# EAGLE design thewing_rev0 (EAGLE 9.2.2)

## Sheet 1 of 3
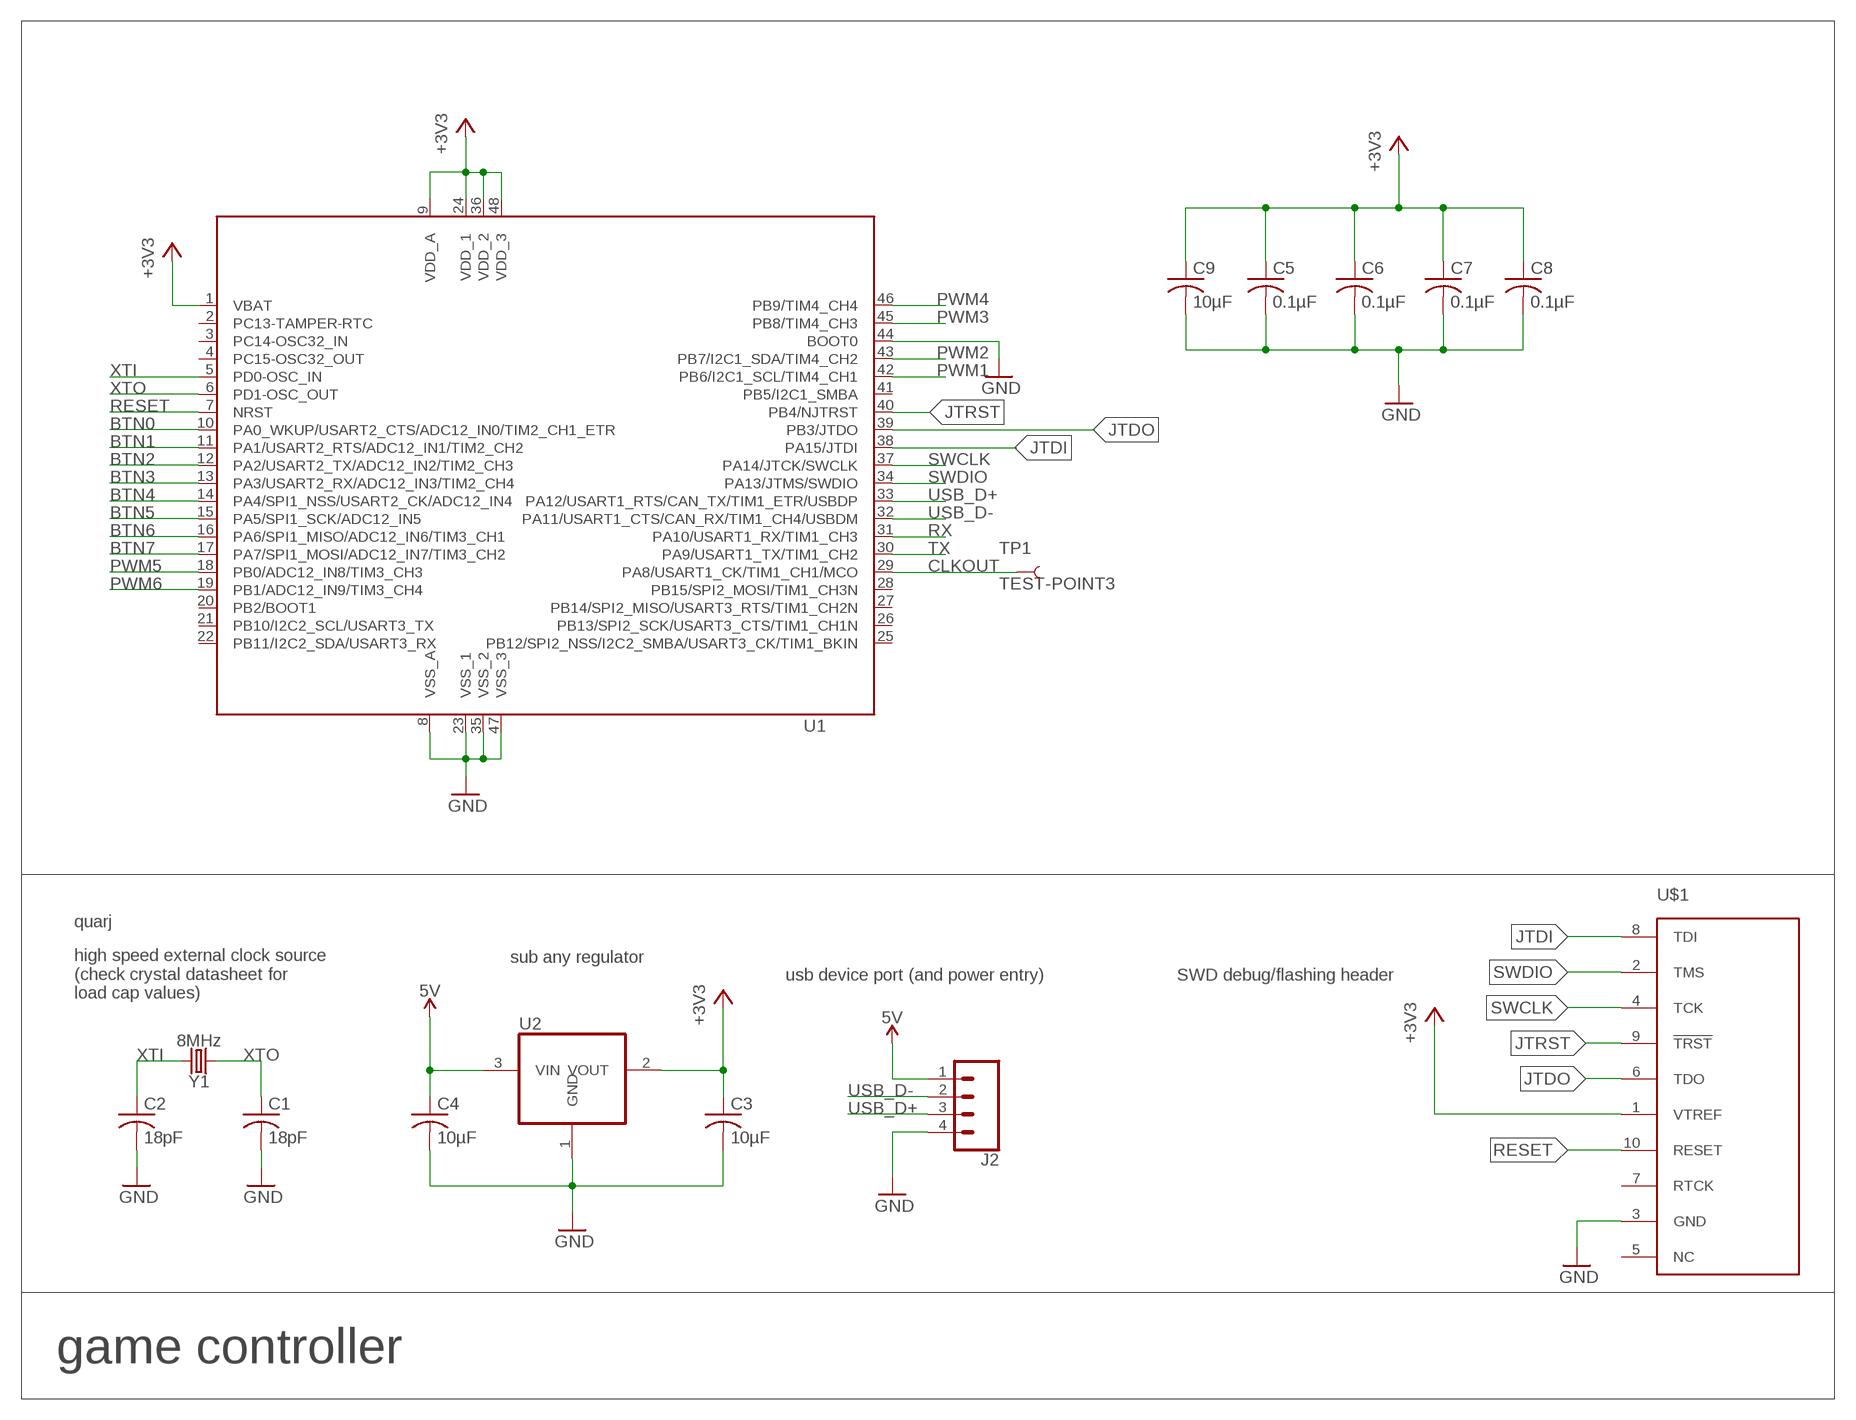
[diagram p0: schematic, sheet 1]

### Parts
C1  18pF  RCL_C-USC0805K  [RCL_C0805K]
C2  18pF  RCL_C-USC0805K  [RCL_C0805K]
C3  10µF  RCL_C-USC0805K  [RCL_C0805K]
C4  10µF  RCL_C-USC0805K  [RCL_C0805K]
C5  0.1µF  RCL_C-USC0805K  [RCL_C0805K]
C6  0.1µF  RCL_C-USC0805K  [RCL_C0805K]
C7  0.1µF  RCL_C-USC0805K  [RCL_C0805K]
C8  0.1µF  RCL_C-USC0805K  [RCL_C0805K]
C9  10µF  RCL_C-USC0805K  [RCL_C0805K]
J2  CONN_04  [1X04]
TP1  TEST-POINT3  [PAD.03X.03]
U1  STM32_STM32F102C4  [STM32_LQFP48]
U2  OG-VREG_REG1117  [OG-VREG_SOT223]
U$1  TC2050-NL-MCP-NL  [TC2030-MCP-NL]
Y1  8MHz  CRYSTAL-8MHZSMD-HC49UP  [HC49UP]

### Nets
5V: C4.1 J2.1 U2.3(VIN)
+3V3: C3.1 C5.1 C6.1 C7.1 C8.1 C9.1 U1.1(VBAT) U1.9(VDD_A) U1.24(VDD_1) U1.36(VDD_2) U1.48(VDD_3) U2.2(VOUT) U$1.1(VTREF) ; also sheet 2
BTN0: U1.10(PA0_WKUP/USART2_CTS/ADC12_IN0/TIM2_CH1_ETR) ; also sheet 2
BTN1: U1.11(PA1/USART2_RTS/ADC12_IN1/TIM2_CH2) ; also sheet 2
BTN2: U1.12(PA2/USART2_TX/ADC12_IN2/TIM2_CH3) ; also sheet 3
BTN3: U1.13(PA3/USART2_RX/ADC12_IN3/TIM2_CH4) ; also sheet 3
BTN4: U1.14(PA4/SPI1_NSS/USART2_CK/ADC12_IN4) ; also sheet 3
BTN5: U1.15(PA5/SPI1_SCK/ADC12_IN5) ; also sheet 3
BTN6: U1.16(PA6/SPI1_MISO/ADC12_IN6/TIM3_CH1) ; also sheet 3
BTN7: U1.17(PA7/SPI1_MOSI/ADC12_IN7/TIM3_CH2) ; also sheet 3
CLKOUT: TP1.P$1 U1.29(PA8/USART1_CK/TIM1_CH1/MCO)
GND: C1.2 C2.2 C3.2 C4.2 C5.2 C6.2 C7.2 C8.2 C9.2 J2.4 U1.8(VSS_A) U1.23(VSS_1) U1.35(VSS_2) U1.44(BOOT0) U1.47(VSS_3) U2.1(GND) U$1.3(GND) ; also sheet 2,3
JTDI: U1.38(PA15/JTDI) U$1.8(TDI)
JTDO: U1.39(PB3/JTDO) U$1.6(TDO)
JTRST: U1.40(PB4/NJTRST) U$1.9(!TRST)
PWM1: U1.42(PB6/I2C1_SCL/TIM4_CH1) ; also sheet 2
PWM2: U1.43(PB7/I2C1_SDA/TIM4_CH2) ; also sheet 2
PWM3: U1.45(PB8/TIM4_CH3) ; also sheet 2
PWM4: U1.46(PB9/TIM4_CH4) ; also sheet 2
PWM5: U1.18(PB0/ADC12_IN8/TIM3_CH3) ; also sheet 2
PWM6: U1.19(PB1/ADC12_IN9/TIM3_CH4) ; also sheet 2
RESET: U1.7(NRST) U$1.10(RESET)
RX: U1.31(PA10/USART1_RX/TIM1_CH3)
SWCLK: U1.37(PA14/JTCK/SWCLK) U$1.4(TCK)
SWDIO: U1.34(PA13/JTMS/SWDIO) U$1.2(TMS)
TX: U1.30(PA9/USART1_TX/TIM1_CH2)
USB_D+: J2.3 U1.33(PA12/USART1_RTS/CAN_TX/TIM1_ETR/USBDP)
USB_D-: J2.2 U1.32(PA11/USART1_CTS/CAN_RX/TIM1_CH4/USBDM)
XTI: C2.1 U1.5(PD0-OSC_IN) Y1.2
XTO: C1.1 U1.6(PD1-OSC_OUT) Y1.1
Unconnected: U1.2(PC13-TAMPER-RTC) U1.3(PC14-OSC32_IN) U1.4(PC15-OSC32_OUT) U1.20(PB2/BOOT1) U1.21(PB10/I2C2_SCL/USART3_TX) U1.22(PB11/I2C2_SDA/USART3_RX) U1.25(PB12/SPI2_NSS/I2C2_SMBA/USART3_CK/TIM1_BKIN) U1.26(PB13/SPI2_SCK/USART3_CTS/TIM1_CH1N) U1.27(PB14/SPI2_MISO/USART3_RTS/TIM1_CH2N) U1.28(PB15/SPI2_MOSI/TIM1_CH3N) U1.41(PB5/I2C1_SMBA) U$1.5(NC) U$1.7(RTCK)

### Notes on the sheet
- quarj
- sub any regulator
- usb device port (and power entry) | SWD debug/flashing header
- high speed external clock source
  (check crystal datasheet for 
  load cap values)
- game controller

## Sheet 2 of 3
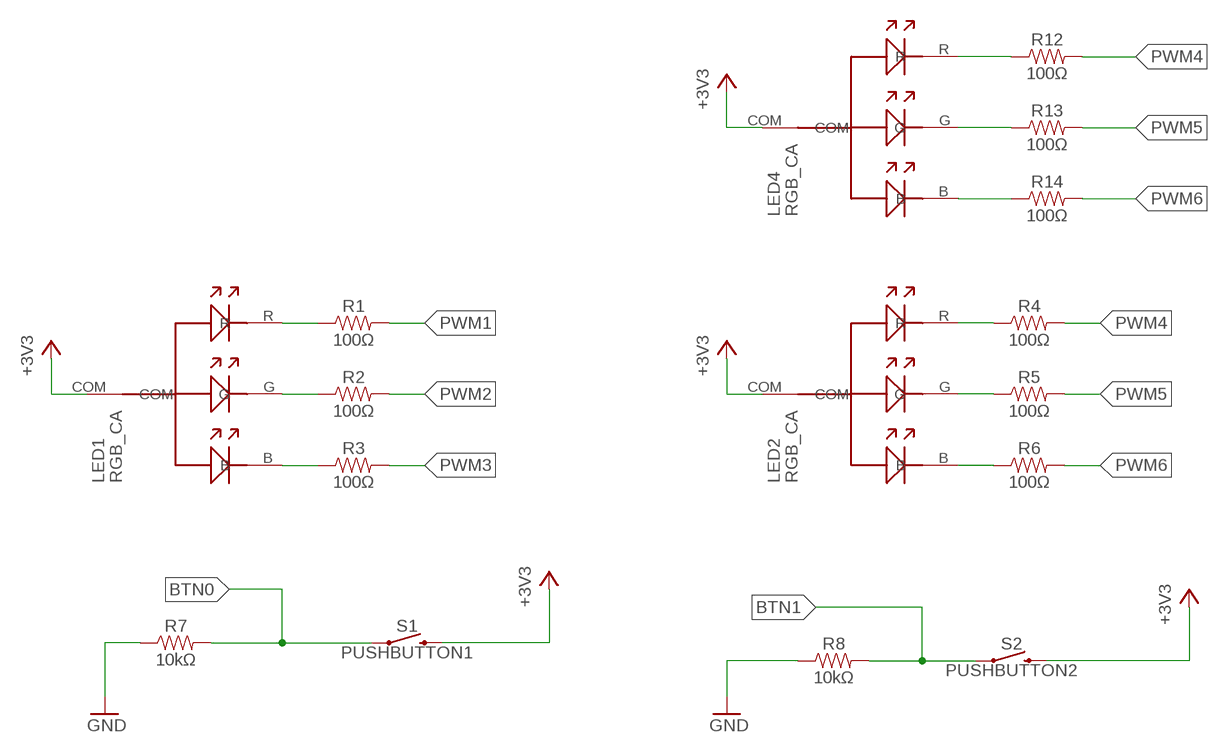
[diagram p1: schematic, sheet 2]

### Parts
LED1  RGB_CA  RGB_LED_RECTANGULAR_COMMON_ANODE  [RGB_LED_RECTANGULAR_COMMON_ANODE]
LED2  RGB_CA  RGB_LED_RECTANGULAR_COMMON_ANODE  [RGB_LED_RECTANGULAR_COMMON_ANODE]
LED4  RGB_CA  RGB_LED_RECTANGULAR_COMMON_ANODE  [RGB_LED_RECTANGULAR_COMMON_ANODE]
R1  100Ω  0.3OHM-0805-1/8W-1%  [0805]
R2  100Ω  0.3OHM-0805-1/8W-1%  [0805]
R3  100Ω  0.3OHM-0805-1/8W-1%  [0805]
R4  100Ω  0.3OHM-0805-1/8W-1%  [0805]
R5  100Ω  0.3OHM-0805-1/8W-1%  [0805]
R6  100Ω  0.3OHM-0805-1/8W-1%  [0805]
R7  10kΩ  0.3OHM-0805-1/8W-1%  [0805]
R8  10kΩ  0.3OHM-0805-1/8W-1%  [0805]
R12  100Ω  0.3OHM-0805-1/8W-1%  [0805]
R13  100Ω  0.3OHM-0805-1/8W-1%  [0805]
R14  100Ω  0.3OHM-0805-1/8W-1%  [0805]
S1  PUSHBUTTON1  MOMENTARY-SWITCH-SPST-PTH-6.0MM  [TACTILE_SWITCH_PTH_6.0MM]
S2  PUSHBUTTON2  MOMENTARY-SWITCH-SPST-PTH-6.0MM  [TACTILE_SWITCH_PTH_6.0MM]

### Nets
+3V3: LED1.COM LED2.COM LED4.COM S1.3 S2.3 ; also sheet 1
BTN0: R7.2 S1.1 ; also sheet 1
BTN1: R8.2 S2.1 ; also sheet 1
GND: R7.1 R8.1 ; also sheet 1,3
N$1: LED1.R R1.1
N$2: LED1.G R2.1
N$3: LED1.B R3.1
N$4: LED2.R R4.1
N$5: LED2.G R5.1
N$6: LED2.B R6.1
N$10: LED4.R R12.1
N$11: LED4.G R13.1
N$12: LED4.B R14.1
PWM1: R1.2 ; also sheet 1
PWM2: R2.2 ; also sheet 1
PWM3: R3.2 ; also sheet 1
PWM4: R4.2 R12.2 ; also sheet 1
PWM5: R5.2 R13.2 ; also sheet 1
PWM6: R6.2 R14.2 ; also sheet 1

## Sheet 3 of 3
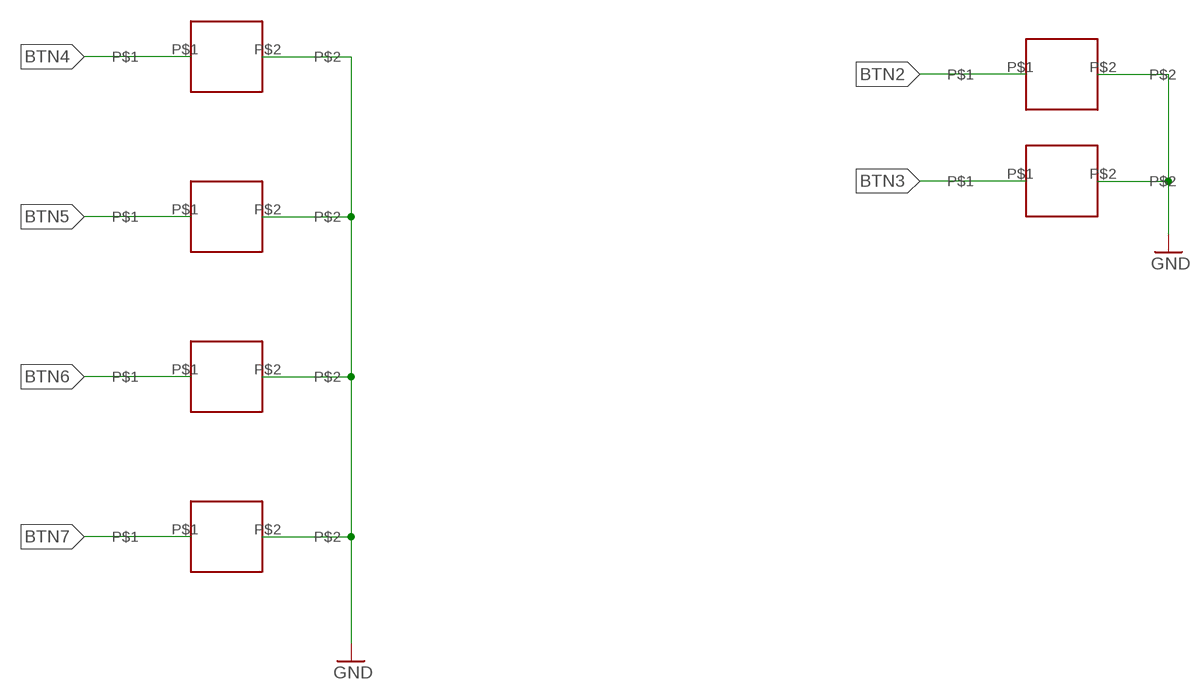
[diagram p2: schematic, sheet 3]

### Parts
A  HYPERKIN_TOUCHPAD_CADET  [HYPERKIN_TOUCHPLATE_CADET]
B  HYPERKIN_TOUCHPAD_CADET  [HYPERKIN_TOUCHPLATE_CADET]
D  HYPERKIN_TOUCHPAD_CADET  [HYPERKIN_TOUCHPLATE_CADET]
L  HYPERKIN_TOUCHPAD_CADET  [HYPERKIN_TOUCHPLATE_CADET]
R  HYPERKIN_TOUCHPAD_CADET  [HYPERKIN_TOUCHPLATE_CADET]
U  HYPERKIN_TOUCHPAD_CADET  [HYPERKIN_TOUCHPLATE_CADET]

### Nets
BTN2: A.P$1 ; also sheet 1
BTN3: B.P$1 ; also sheet 1
BTN4: U.P$1 ; also sheet 1
BTN5: D.P$1 ; also sheet 1
BTN6: L.P$1 ; also sheet 1
BTN7: R.P$1 ; also sheet 1
GND: A.P$2 B.P$2 D.P$2 L.P$2 R.P$2 U.P$2 ; also sheet 1,2

## Library data of the parts
A B D L R U = hyperkin_cadet_touchplate:HYPERKIN_TOUCHPAD_CADET
C1-C9 = braids_v50:RCL_C-US: CAPACITOR, American symbol
J2 = SparkFun-Connectors:CONN_04: Multi connection point. Often used as Generic Header-pin footprint for 0.1 inch spaced/style header connections On any of the 0.1 inch spaced packages, you can populate with these: Break Away Headers - Straight <https://www.sparkfun.com/products/116> (PRT-00116) Break Away Male Headers - Right Angle <https://www.sparkfun.com/products/553> (PRT-00553) Female Headers <https://www.sparkfun.com/products/115> (PRT-00115) Break Away Headers - Machine Pin <https://www.sparkfun.com/products/117> (PRT-00117) Break Away Female Headers - Swiss Machine Pin <https://www.sparkfun.com/products/743> (PRT-00743) For SCREWTERMINALS and SPRING TERMINALS visit here: Screw Terimnals on SparkFun.com <https://www.sparkfun.com/search/results?term=Screw+Terminals> (5mm/3.5mm/2.54mm spacing) This device is also useful as a general connection point to wire up your design to another part of your project. Our various solder wires solder well into these plated through hole pads. Hook-Up Wire - Assortment (Stranded, 22 AWG) <https://www.sparkfun.com/products/11375> (PRT-11375) Hook-Up Wire - Assortment (Solid Core, 22 AWG) <https://www.sparkfun.com/products/11367> (PRT-11367) View the entire wire category on our website here <https://www.sparkfun.com/categories/141> Special notes: Molex polarized connector foot print use with SKU : PRT-08231 with associated crimp pins and housings. 1MM SMD Version SKU: PRT-10208; PROD_ID: CONN-09696
LED1 LED2 LED4 = rgb_led_common_anode_rectangular:RGB_LED_RECTANGULAR_COMMON_ANODE
R1-R8 R12-R14 = SparkFun-Resistors:0.3OHM: 0.3Ω resistor A resistor is a passive two-terminal electrical component that implements electrical resistance as a circuit element. Resistors act to reduce current flow, and, at the same time, act to lower voltage levels within circuits. - Wikipedia; PROD_ID: RES-11622; VALUE: 0.3
S1 S2 = SparkFun-Switches:MOMENTARY-SWITCH-SPST: Momentary Switch (Pushbutton) - SPST Normally-open (NO) SPST momentary switches (buttons, pushbuttons). Variants PTH-12MM - 12mm square, through-hole Momentary Pushbutton Switch - 12mm Square <https://www.sparkfun.com/products/9190> (COM-09190) PTH-6.0MM, PTH-6.0MM-KIT - 6.0mm square, through-hole Mini Pushbutton Switch <https://www.sparkfun.com/products/97> (COM-00097) KIT package intended for soldering kit's - only one side of pads' copper is exposed. PTH-RIGHT-ANGLE-KIT - Right-angle, through-hole Right Angle Tactile Button <https://www.sparkfun.com/products/10791> - Used on SparkFun BigTime Watch Kit <https://www.sparkfun.com/products/11734> SMD-12MM - 12mm square, surface-mount Tactile Button - SMD (12mm) <https://www.sparkfun.com/products/12993> (COM-12993) Used on SparkFun PicoBoard <https://www.sparkfun.com/products/11888> SMD-4.5MM - 4.5mm Square Trackball Switch Used on SparkFun Blackberry Trackballer Breakout <https://www.sparkfun.com/products/13169> SMD-4.6MMX2.8MM - 4.60mm x 2.80mm, surface mount Used on SparkFun SAMD21 Mini Breakout <https://www.sparkfun.com/products/13664> SMD-5.2MM, SMD-5.2-REDUNDANT - 5.2mm square, surface-mount Mini Pushbutton Switch - SMD <https://www.sparkfun.com/products/8720> (COM-08720) Used on Arduino Pro Mini <https://www.sparkfun.com/products/11114> REDUNDANT package connects both switch circuits together SMD-6.0X3.5MM - 6.0 x 3.5mm, surface mount Momentary Reset Switch SMD <https://www.sparkfun.com/products/8229> (COM-08229) SMD-6.2MM-TALL - 6.2mm square, surface mount Tactile Button - SMD (6mm) <https://www.sparkfun.com/products/12992> Used on SparkFun Digital Sandbox <https://www.sparkfun.com/products/12651> SMD-RIGHT-ANGLE - Right-angle, surface mount Used on SparkFun Block for Intel® Edison - Arduino <https://www.sparkfun.com/products/13036>; PROD_ID: SWCH-08441; SF_SKU: COM-00097
TP1 = SparkFun-Connectors:TEST-POINT: SparkFun Test Points Bare copper test points for troubleshooting or In-Circuit-Testing. These are used by our Production team for verifying production board runs using pogo-pins on test beds. SparkFun Products: SparkFun LSM9DS1 Breakout <https://www.sparkfun.com/products/13284> SparkFun PSOC <https://www.sparkfun.com/products/13714> SparkFun Load Cell Amplifier <https://www.sparkfun.com/products/13879>
U1 = braids_v50:STM32_STM32F102C4
U2 = braids_v50:OG-VREG_REG1117: 800mA and 1A Low Dropout (LDO) Positive Regulator 1.8V, 2.5V, 2.85V, 3.3V, 5V, and Adj
U$1 = TC2050:TC2050-NL: TAG-CONNECT ISP Connector Manufacturer: Tag-Connect <www.tag-connect.com> Cable for easy In-Circuit PCB Programming. Designed for JTAG 10 pin, suitable for many others. Pin Connection for TC2050 NL. PAD Description 1 VTREF 2 TMS 3 GND 4 TCK 5 NC 6 TDO 7 RTCK 8 TDI 9 !TRST 10 RESET ©2009 ROFA.cz Modified 7/2011 by Tim McCarthy-Smith VIDA Products INC
Y1 = SparkFun-Clocks:CRYSTAL-8MHZ: 8MHz Crystal Datasheet Example <http://www.futureelectronics.com/en/technologies/electromechanical/timing-devices/crystals/Pages/6008189-ABM3B-8.000MHZ-B2-T.aspx?IM=0> Frequency: 8MHz Frequency Tolerance: ±20ppm Load Capacitance: 18pF SparkFun Products: Pro Micro -3.3V/8MHz <https://www.sparkfun.com/products/12587> WAV Trigger <https://www.sparkfun.com/products/13660>; PROD_ID: XTAL-11706

## Board
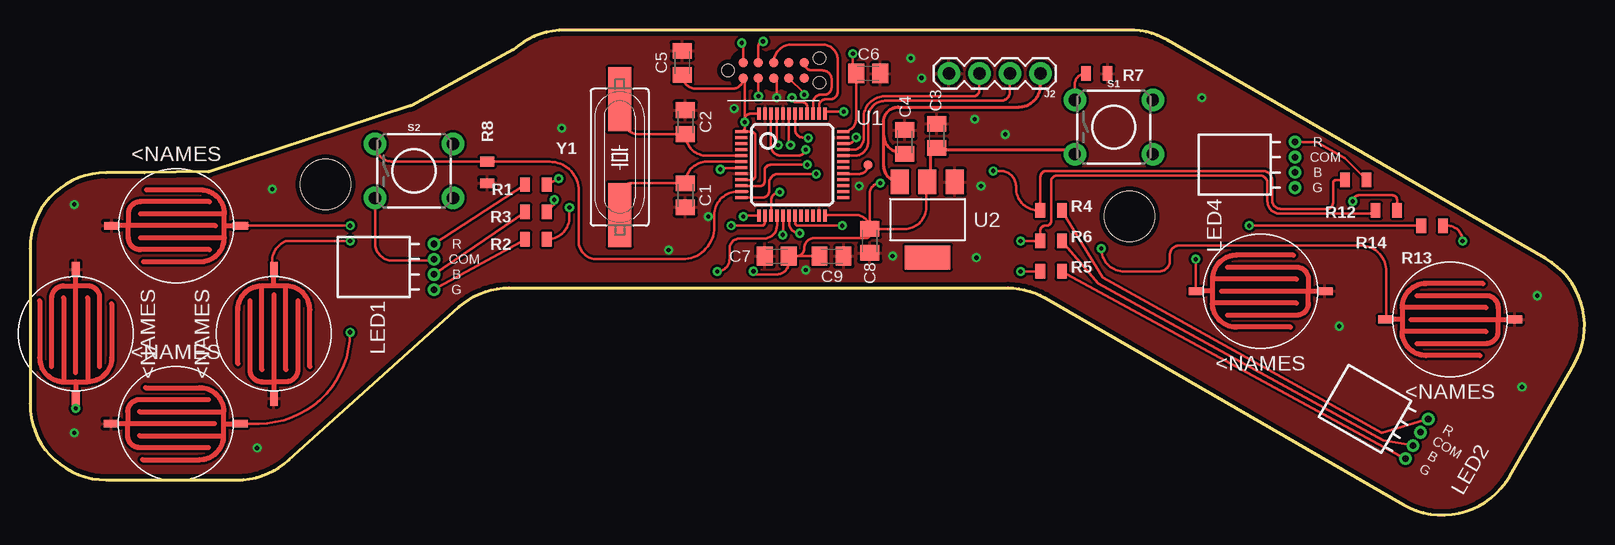
[diagram p3: board, top side]
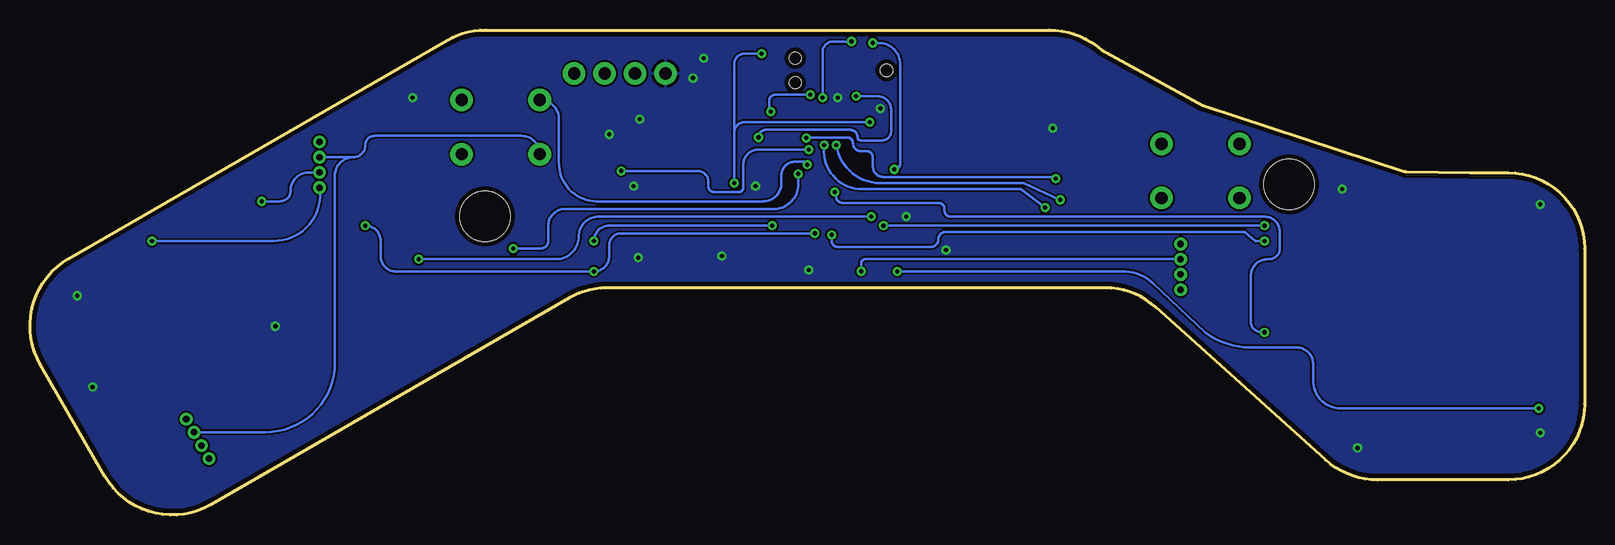
[diagram p4: board, bottom side, seen from below]

Size 129.54 x 40.45 mm. Coordinates in mm from the lower left corner, seen from the top.
Outline: 114.47,0.86 arc90 123.3,3.23 128.68,12.56 arc90 126.32,21.39 94.79,39.59 arc30 91.56,40.45 44.59,40.45 arc42 40.27,38.79 31.79,34.15 31.72,34.12 14.96,28.64 arc-17 14.85,28.62 9.53,28.55 6.35,28.55 arc90 0,22.2 0,9.28 arc90 6.35,2.93 17.25,2.93 arc42 21.58,4.59 35.74,17.33 arc-42 39.91,18.94 81.49,18.94 arc-30 84.61,18.1 114.47,0.86
Copper layers (1*16): Top 0.035mm / dielectric 1.5mm / Bottom 0.035mm
Design rules "default *": minimum track width 6mil, minimum drill 0.35mm, track to track 6mil, track to pad 6mil, pad to pad 6mil, via to via 6mil, smd to smd 6mil, copper to edge 15mil, drill to drill 6mil, minimum pad ring 10mil, minimum via ring 8mil, stop-mask expansion 4mil, vias tented up to drill 0mil, thermal gap 10mil
Holes 4.19 mm at 24.62,27.57 91.64,24.9

### Footprints (pad centres in the part's own frame; a part is rotated, then mirrored left to right if it is on the bottom)
HYPERKIN_TOUCHPLATE_CADET = smd 1.27 x 0.635: P$1 -5.35,0; P$2 5.37,0
RCL_C0805K = smd 1.3 x 1.6: 1 -1,0; 2 1,0
1X04 = drill 1.016 pad 1.88: 1 0,0; 2 2.54,0; 3 5.08,0; 4 7.62,0
RGB_LED_RECTANGULAR_COMMON_ANODE = drill 0.55: B -0.635,0; COM 0.635,0; G -1.905,0; R 1.905,0
0805 = smd 0.8 x 1.2: 1 -0.9,0; 2 0.9,0
TACTILE_SWITCH_PTH_6.0MM = drill 1.016 pad 1.88: 1 -3.251,2.261; 2 3.251,2.261; 3 -3.251,-2.261; 4 3.251,-2.261
PAD.03X.03 = smd 0.762 x 0.762: P$1 0,0
STM32_LQFP48 = smd 0.254 x 1: 1 -2.75,-4.25; 2 -2.25,-4.25; 3 -1.75,-4.25; 4 -1.25,-4.25; 5 -0.75,-4.25; 6 -0.25,-4.25; 7 0.25,-4.25; 8 0.75,-4.25; 9 1.25,-4.25; 10 1.75,-4.25; 11 2.25,-4.25; 12 2.75,-4.25; 25 2.75,4.25; 26 2.25,4.25; 27 1.75,4.25; 28 1.25,4.25; 29 0.75,4.25; 30 0.25,4.25; 31 -0.25,4.25; 32 -0.75,4.25; 33 -1.25,4.25; 34 -1.75,4.25; 35 -2.25,4.25; 36 -2.75,4.25 | smd 1 x 0.254: 13 4.25,-2.75; 14 4.25,-2.25; 15 4.25,-1.75; 16 4.25,-1.25; 17 4.25,-0.75; 18 4.25,-0.25; 19 4.25,0.25; 20 4.25,0.75; 21 4.25,1.25; 22 4.25,1.75; 23 4.25,2.25; 24 4.25,2.75; 37 -4.25,2.75; 38 -4.25,2.25; 39 -4.25,1.75; 40 -4.25,1.25; 41 -4.25,0.75; 42 -4.25,0.25; 43 -4.25,-0.25; 44 -4.25,-0.75; 45 -4.25,-1.25; 46 -4.25,-1.75; 47 -4.25,-2.25; 48 -4.25,-2.75
OG-VREG_SOT223 = smd 1.499 x 2.007: 1 -2.261,-3.15; 2 0.025,-3.15; 3 2.311,-3.15 | smd 3.81 x 2.007: 4 0,3.15
TC2030-MCP-NL = smd 0.787 x 0.787: 1 1.27,-0.635; 2 2.54,-0.635; 3 3.81,-0.635; 4 5.08,-0.635; 5 6.35,-0.635; 6 6.35,0.635; 7 5.08,0.635; 8 3.81,0.635; 9 2.54,0.635; 10 1.27,0.635; 11 1.27,0.635; 12 1.27,0.635 | hole 1: 0,0; 7.62,-1.016; 7.62,1.016
HC49UP = smd 5.334 x 1.93: 1 -4.826,0; 2 4.826,0

### Placement (x,y rotation side)
A  118.34,16.3 0 top
B  102.54,18.67 0 top
C1  54.61,26.67 270 top
C2  54.61,32.76 90 top
C3  75.56,31.62 90 top
C4  72.9,31.11 90 top
C5  54.36,37.72 90 top
C6  69.85,36.83 0 top
C7  62.23,21.59 180 top
C8  69.98,22.86 270 top
C9  66.8,21.59 0 top
D  12.14,7.62 180 top
J2  84.2,36.83 180 top
L  3.81,15.11 90 top
LED1  33.66,20.7 90 top
LED2  115.57,6.35 60 top
LED4  105.41,29.21 90 top
R  20.32,15.11 270 top
R1  42.16,27.56 0 top
R2  42.16,22.98 0 top
R3  42.16,25.27 0 top
R4  85.09,25.4 180 top
R5  85.09,20.32 180 top
R6  85.09,22.86 180 top
R7  88.9,36.83 180 top
R8  38.1,28.57 90 top
R12  110.49,27.94 180 top
R13  116.84,24.13 180 top
R14  113.03,25.4 180 top
S1  90.32,32.36 0 top
S2  32,28.7 0 top
TP1  69.85,29.21 0 top
U  12.19,24.13 180 top
U1  63.5,29.21 270 top
U2  74.8,24.63 180 top
U$1  58.17,37.08 0 top
Y1  49.15,29.84 90 top

### Tracks (layer width: path | path; a pad name or v marks a point on that pad's centre or on a via)
5V
  Top 0.254: U2.3 arc-90 71.12,29.16 71.12,31.75 | 71.12,31.75 71.12,32.76 arc-90 72.39,34.03 82.42,34.03 arc90 84.2,35.81 J2.1 | C4.1 72.9,30.22 72.64,30.22 arc-90 71.12,31.75
+3V3  (via drill 0.35)
  Top 0.203: U1.24 arc-90 66.31,25.02 68.83,25.02 arc-90 69.98,23.87 C8.1 | C8.1 arc-90 69.87,23.75 | C7.1 63.88,21.59 arc90 64.52,22.22 arc-90 65.41,23.11 69.72,23.11 arc90 69.98,23.36 C8.1 | U2.2 arc-90 74.68,27.68 74.68,25.65 arc-90 72.88,23.86 C8.1 | C7.1 C9.1 | C8.1 69.98,26.79 arc-90 v70.87,27.68 | S2.3 28.75,22.68 arc90 30.23,21.21 33.53,21.21 arc90 LED1.COM | U1.36 arc90 68.85,33.06 C6.1 arc-90 68.58,37.1 v68.58,38.48 | C7.1 63.23,21.06 arc-90 62.23,20.06 60.55,20.06 arc-90 v60.28,20.33 | 59.56,33.02 59.56,36.32 arc90 U$1.1 arc-90 58.55,35.56 55.52,35.56 arc-90 C5.1 | 59.56,33.02 v59.56,32.76 59.56,32.27 arc-90 U1.1 60.12,31.96 arc-90 60.45,31.62 60.45,28.32 arc-90 60.07,27.94 59.27,27.94 arc-90 U1.9 | U1.48 60,33.46 arc90 59.56,33.02
  Top 0.254: U2.2 arc90 75.06,28.06 75.06,30.35 arc-90 75.33,30.62 C3.1 arc90 75.71,30.48 86.69,30.48 arc-90 S1.3
  Bottom 0.203: S1.3 arc-90 88.59,31.62 100.84,31.62 arc-90 101.6,30.86 arc90 102.62,29.84 | 102.62,29.84 LED4.COM | 102.62,29.84 arc-90 104.14,28.32 104.14,12.7 arc90 109.94,6.9 LED2.COM | LED1.COM 59.94,21.33 arc-90 60.28,20.99 v60.28,20.33 | 70.87,31.87 arc90 69.98,32.76 v59.56,32.76 | 70.87,31.87 v70.87,27.68 | v68.58,38.48 69.98,38.48 arc-90 70.87,37.59 70.87,31.87
BTN0  (via drill 0.35)
  Top 0.203: R7.2 arc90 87.07,35.89 S1.1 | U1.10 arc90 59.28,27.43 60.83,27.43 arc90 61.21,27.81 61.21,28.7 arc-90 61.72,29.21 v64.77,29.21
  Bottom 0.203: S1.1 arc90 85.47,33.02 85.47,29.33 arc-90 82.3,26.16 68.45,26.16 arc-90 66.93,27.68 66.93,28.32 arc90 65.79,29.46 65.02,29.46 arc90 v64.77,29.21
BTN1
  Top 0.203: U1.11 arc-90 59.27,26.97 | 59.27,26.97 59.56,26.97 59.82,26.97 | S2.1 arc90 30.24,29.47 R8.2 arc-90 38.34,29.71 arc90 38.6,29.46 43.31,29.46 arc-90 45.72,27.05 45.72,22.86 arc90 47.24,21.33 54.36,21.33 arc90 57.02,24 57.02,25.02 arc-90 58.98,26.97 59.27,26.97
BTN2  (via drill 0.35)
  Top 0.203: A.P$1 arc90 113.03,16.34 113.03,20.32 arc90 110.87,22.48 95.76,22.48 arc90 95,21.71 95,21.21 arc-90 94.11,20.32 91.19,20.32 arc-90 v89.28,22.22 | U1.12 61,26.46 arc90 61.59,27.05 61.59,27.68 arc-90 62.36,28.44 62.87,28.44 62.99,28.44 v65.53,28.44
  Bottom 0.203: v65.53,28.44 65.53,27.56 arc90 67.56,25.52 84.96,25.52 arc-90 86.36,24.13 86.36,22.86 arc90 87,22.22 v89.28,22.22
BTN3  (via drill 0.35)
  Top 0.203: B.P$1 arc-90 97.16,18.7 v97.16,21.33 | v59.44,24.89 arc-90 59.5,24.96 U1.13
  Bottom 0.203: v59.44,24.89 82.17,24.89 arc-90 83.82,23.24 arc90 85.72,21.33 v97.16,21.33
BTN4  (via drill 0.35)
  Top 0.203: U.P$1 v26.67,24.13 | v58.42,24.13 60.96,24.13 arc90 61.25,24.42 U1.14
  Bottom 0.203: v26.67,24.13 v58.42,24.13
BTN5  (via drill 0.35)
  Top 0.203: v26.67,15.24 arc-90 19.05,7.62 D.P$1 | v62.48,26.92 arc90 61.75,26.19 U1.15
  Bottom 0.203: v62.48,26.92 arc-90 62.36,26.79 62.36,26.54 arc-90 61.85,26.03 53.85,26.03 arc90 53.34,25.52 53.34,25.4 arc-90 52.83,24.89 26.67,24.89 arc90 25.4,23.62 25.4,22.22 arc90 26.29,21.33 26.42,21.33 arc-90 27.81,19.94 27.81,16.13 arc-90 26.92,15.24 v26.67,15.24
BTN6  (via drill 0.35)
  Top 0.203: L.P$1 v3.81,8.89 | U1.16 62.25,24.16 arc-90 61.14,23.05 59.12,23.05 arc90 58.29,22.22 58.29,21.35 arc-90 v57.26,20.32
  Bottom 0.203: v3.81,8.89 20.32,8.89 arc90 22.61,11.17 22.61,12.57 arc-90 24,13.97 27.81,13.97 arc37 31.62,15.24 35.96,19.32 arc-40 38.23,20.32 v57.26,20.32 57.28,20.32
BTN7  (via drill 0.35)
  Top 0.203: R.P$1 arc-90 21.32,22.86 v26.67,22.86 | v62.74,23.36 arc90 v62.75,23.38 U1.17
  Bottom 0.203: v26.67,22.86 27.43,22.86 28.32,23.62 53.21,23.62 arc-90 53.85,22.98 arc90 54.48,22.35 62.23,22.35 arc90 62.74,22.86 v62.74,23.36
CLKOUT
  Top 0.203: U1.29 arc90 67.76,28.44 69.09,28.44 arc90 TP1.P$1
GND  (via drill 0.35)
  Top 0.203: U$1.3 arc-90 62.23,36.19 v62.23,34.79
  other vias: 56.52,24.89 71.88,21.59 53.21,22.09 64.64,20.44 78.74,33.02 81.28,31.75 74.3,36.45 20.19,27.17 3.68,25.9 3.68,6.85 18.92,5.58 44.32,32.25 109.09,15.74 125.6,18.28 124.33,10.66 97.66,34.79 69.09,27.43 79.25,27.43 73.41,38.1 78.87,21.46 58.67,33.91
  pour Top (isolate 0.203): 6.35,2.54 17.78,2.54 arc37 21.59,3.81 arc11 35.56,16.51 arc-53 40.77,18.54 81.28,18.54 83.82,17.78 115.7,-0.64 arc95 123.06,1.65 129.92,13.33 arc79 128.78,20.32 93.47,40.89 43.56,40.89 arc43 41.27,40 31.75,34.67 15.24,29.21 5.71,29.08 arc96 -0.64,21.84 -0.51,8.63 arc90 5.59,2.54
  pour Bottom (isolate 0.152): 5.08,2.54 17.78,2.54 arc37 21.59,3.81 arc11 35.56,16.51 arc-35 38.86,18.41 arc-16 40.64,18.54 81.28,18.54 83.82,17.78 106.3,4.82 115.06,-0.26 arc54 119.51,-0.51 arc34 123.95,3.3 arc3 129.54,12.7 arc73 128.52,20.44 93.98,40.64 93.47,40.89 43.56,40.89 arc43 41.27,40 32,34.79 15.24,29.21 4.95,29.08 arc90 -0.64,23.49 -0.64,20.06 -0.64,8.63 arc86
JTDI
  Top 0.203: U$1.8 arc-90 63.5,39.24 66.04,39.24 | 66.04,39.24 66.17,39.24 | 66.04,39.24 arc-90 67.31,37.97 67.31,35.3 arc-90 66.67,34.67 66.29,34.67 arc90 65.75,34.12 U1.38
JTDO
  Top 0.203: U$1.6 arc90 65.15,37.08 66.04,37.08 arc-90 66.8,36.32 66.8,35.68 arc-90 66.17,35.05 65.91,35.05 arc90 65.25,34.39 U1.39
JTRST  (via drill 0.35)
  Top 0.203: U1.40 arc90 64.77,33.48 64.77,34.03 arc90 64.39,34.41 63.88,34.41 arc-90 v63.5,34.79 | v61.09,39.49 arc90 60.71,39.11 U$1.9
  Bottom 0.203: v61.09,39.49 62.61,39.49 arc-90 63.5,38.6 v63.5,34.79
N$1
  Top 0.203: R1.1 LED1.R
N$2
  Top 0.203: R2.1 LED1.G
N$3
  Top 0.203: R3.1 LED1.B
N$4
  Top 0.203: R4.1 89.41,19.81 112.65,6.85 LED2.R
N$5
  Top 0.203: R5.1 LED2.G
N$6
  Top 0.203: R6.1 89.03,19.3 112.78,6.22 LED2.B
N$10
  Top 0.203: LED4.R 107.24,31.11 109.55,29.78 R12.1
N$11  (via drill 0.35)
  Top 0.203: R13.1 118.11,24.13 arc-90 v119.38,22.86
  Bottom 0.203: v119.38,22.86 109.22,22.86 arc-99 LED4.G
N$12  (via drill 0.35)
  Top 0.203: R14.1 arc-90 113.92,25.41 113.92,26.29 arc90 113.54,26.67 110.74,26.67 arc90 v110.24,26.16
  Bottom 0.203: v110.24,26.16 108.71,26.16 arc-90 107.82,27.05 arc90 106.3,28.57 LED4.B
PWM1  (via drill 0.35)
  Top 0.203: U1.42 arc-90 U1.42 63.75,32.13 arc90 64.39,31.49 64.9,31.49 arc90 v64.85,31.45 | R1.2 43.31,27.68 v44.07,28.06
  Bottom 0.203: v64.85,31.45 arc90 64.8,31.49 61.47,31.49 arc90 60.96,30.98 arc-90 60.33,30.35 59.82,30.35 arc90 59.31,29.84 59.31,29.08 arc-90 58.42,28.19 44.25,28.19 arc-90 44.22,28.22 v44.07,28.06
PWM2  (via drill 0.35)
  Top 0.203: v44.96,25.65 44.96,24.88 arc-90 R2.2 | U1.43 arc90 U1.43 63.25,30.98 arc90 v63.37,30.86
  Bottom 0.203: v44.96,25.65 46.99,27.17 60.19,27.17 arc98 v63.37,30.86
PWM3  (via drill 0.35)
  Top 0.203: v43.69,26.29 43.69,25.89 R3.2 | U1.45 arc90 62.23,33.44 62.23,30.98 arc90 v62.36,30.86
  Bottom 0.203: v43.69,26.29 46.74,27.68 58.68,27.68 arc82 v62.36,30.86
PWM4  (via drill 0.35)
  Top 0.152: 84.19,26.66 arc-90 84.2,26.67 arc-90 84.19,26.66
  Top 0.203: 84.19,26.66 R4.2 84.07,25.4 arc-90 82.17,27.3 82.17,27.43 arc90 80.9,28.7 v80.26,28.7 | R12.2 108.84,27.94 arc90 108.58,27.68 108.58,26.03 arc-90 108.08,25.52 104.27,25.52 arc-90 103.5,26.29 103.5,27.94 arc90 102.74,28.7 84.71,28.7 arc90 84.2,28.19 84.2,26.67 | U1.46 arc90 61.72,33.43 61.72,30.86 arc90 62.61,29.97 64.01,29.97 arc77 v64.64,30.48
  Bottom 0.203: v80.26,28.7 73.91,28.7 arc90 73.03,27.81 73.03,27.43 arc-90 72.52,26.92 70.48,26.92 arc-90 70.1,27.3 70.1,29.21 arc90 68.83,30.48 v64.64,30.48
PWM5  (via drill 0.35)
  Top 0.203: U1.18 63.25,24.38 arc90 v64.14,23.49 | R5.2 v82.55,20.32 | v101.6,24.13 R13.2
  Bottom 0.203: v64.14,23.49 80.26,23.49 arc-90 81.28,22.48 81.28,21.59 arc90 v82.55,20.32 99.06,20.32 arc90 100.33,21.59 100.33,22.86 arc-90 v101.6,24.13
PWM6  (via drill 0.35)
  Top 0.152: 84.19,23.73 arc-90 84.2,23.75 | 111.88,25.14 arc90 R14.2 | U1.19 arc-90 U1.19
  Top 0.203: 84.19,23.73 R6.2 v82.55,22.86 | 84.2,23.75 arc-90 84.58,24.13 84.71,24.13 arc90 85.09,24.51 85.09,27.81 arc-90 85.6,28.32 102.49,28.32 arc-90 103.12,27.68 103.12,26.16 arc90 104.14,25.14 111.88,25.14 | U1.19 63.75,24.38 arc90 64.01,24.13 v67.69,24.13
  Bottom 0.203: v67.69,24.13 81.28,24.13 arc-90 v82.55,22.86
RESET  (via drill 0.35)
  Top 0.203: U1.7 arc-90 U1.7 57.66,28.95 arc90 v57.53,28.83 | v59.31,39.37 arc-90 59.44,39.24 U$1.10
  Bottom 0.203: v57.53,28.83 arc-90 57.02,29.33 57.02,37.59 arc-90 58.8,39.37 v59.31,39.37
SWCLK  (via drill 0.35)
  Top 0.203: U$1.4 64.52,35.18 v64.52,35.05 | v67.82,33.65 66.44,33.65 arc90 U1.37
  Bottom 0.203: v67.82,33.65 arc90 67.94,33.78 67.94,34.54 arc90 67.44,35.05 v64.52,35.05
SWDIO  (via drill 0.35)
  Top 0.203: U1.34 68.17,30.96 arc90 68.71,31.49 v68.84,31.49 | U$1.2 v60.71,34.92
  Bottom 0.203: v60.71,34.92 58.93,34.92 arc90 57.78,33.78 57.78,32 arc90 58.55,31.24 60.33,31.24 arc90 60.58,31.49 arc-90 61.21,32.13 63.5,32.13 68.2,32.13 arc-90 v68.84,31.49
USB_D+
  Top 0.203: U1.33 68.56,30.46 arc90 69.47,31.37 69.47,33.14 arc-90 71.25,34.92 78.61,34.92 arc90 79.12,35.43 J2.3
USB_D-
  Top 0.203: U1.32 68.69,29.96 arc90 69.85,31.11 69.85,33.14 arc-90 71.25,34.54 80.9,34.54 arc90 81.66,35.3 J2.2
XTI
  Top 0.203: U1.5 56.42,29.96 arc-90 C2.1 50.66,31.76 arc-90 49.53,32.89 49.53,34.29 arc90 Y1.2
XTO
  Top 0.203: U1.6 arc90 U1.6 56.4,29.46 arc90 C1.1 arc90 54.59,27.68 50.04,27.68 arc90 49.4,27.05 49.4,25.78 arc90 49.91,25.27 49.66,25.02 Y1.1